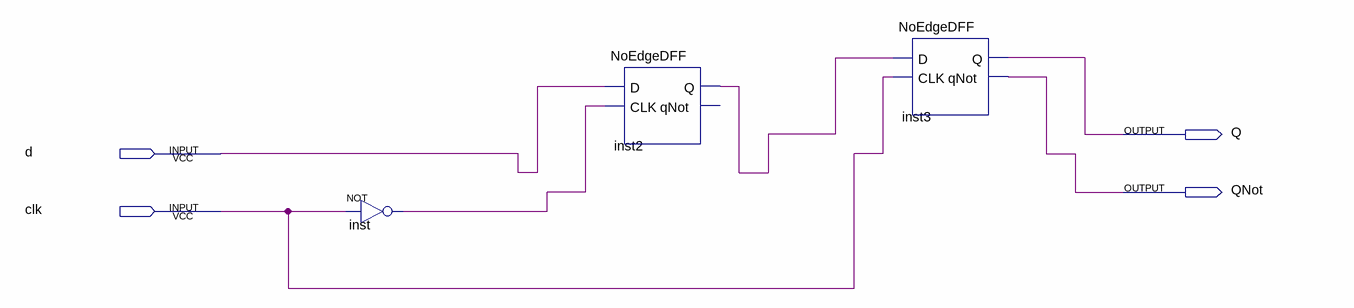
[diagram p0: schematic sheet]
// Quartus schematic UpDFF.bdf as structural Verilog: 3 symbols, 4 pins
module UpDFF (
  input  d,
  input  clk,
  output Q,
  output QNot
);

  wire inst2_q, inst_out;

  not inst (inst_out, clk);
  NoEdgeDFF inst2 (.D(d), .CLK(inst_out), .Q(inst2_q));  // open: qNot
  NoEdgeDFF inst3 (.D(inst2_q), .CLK(clk), .Q(Q), .qNot(QNot));
endmodule
